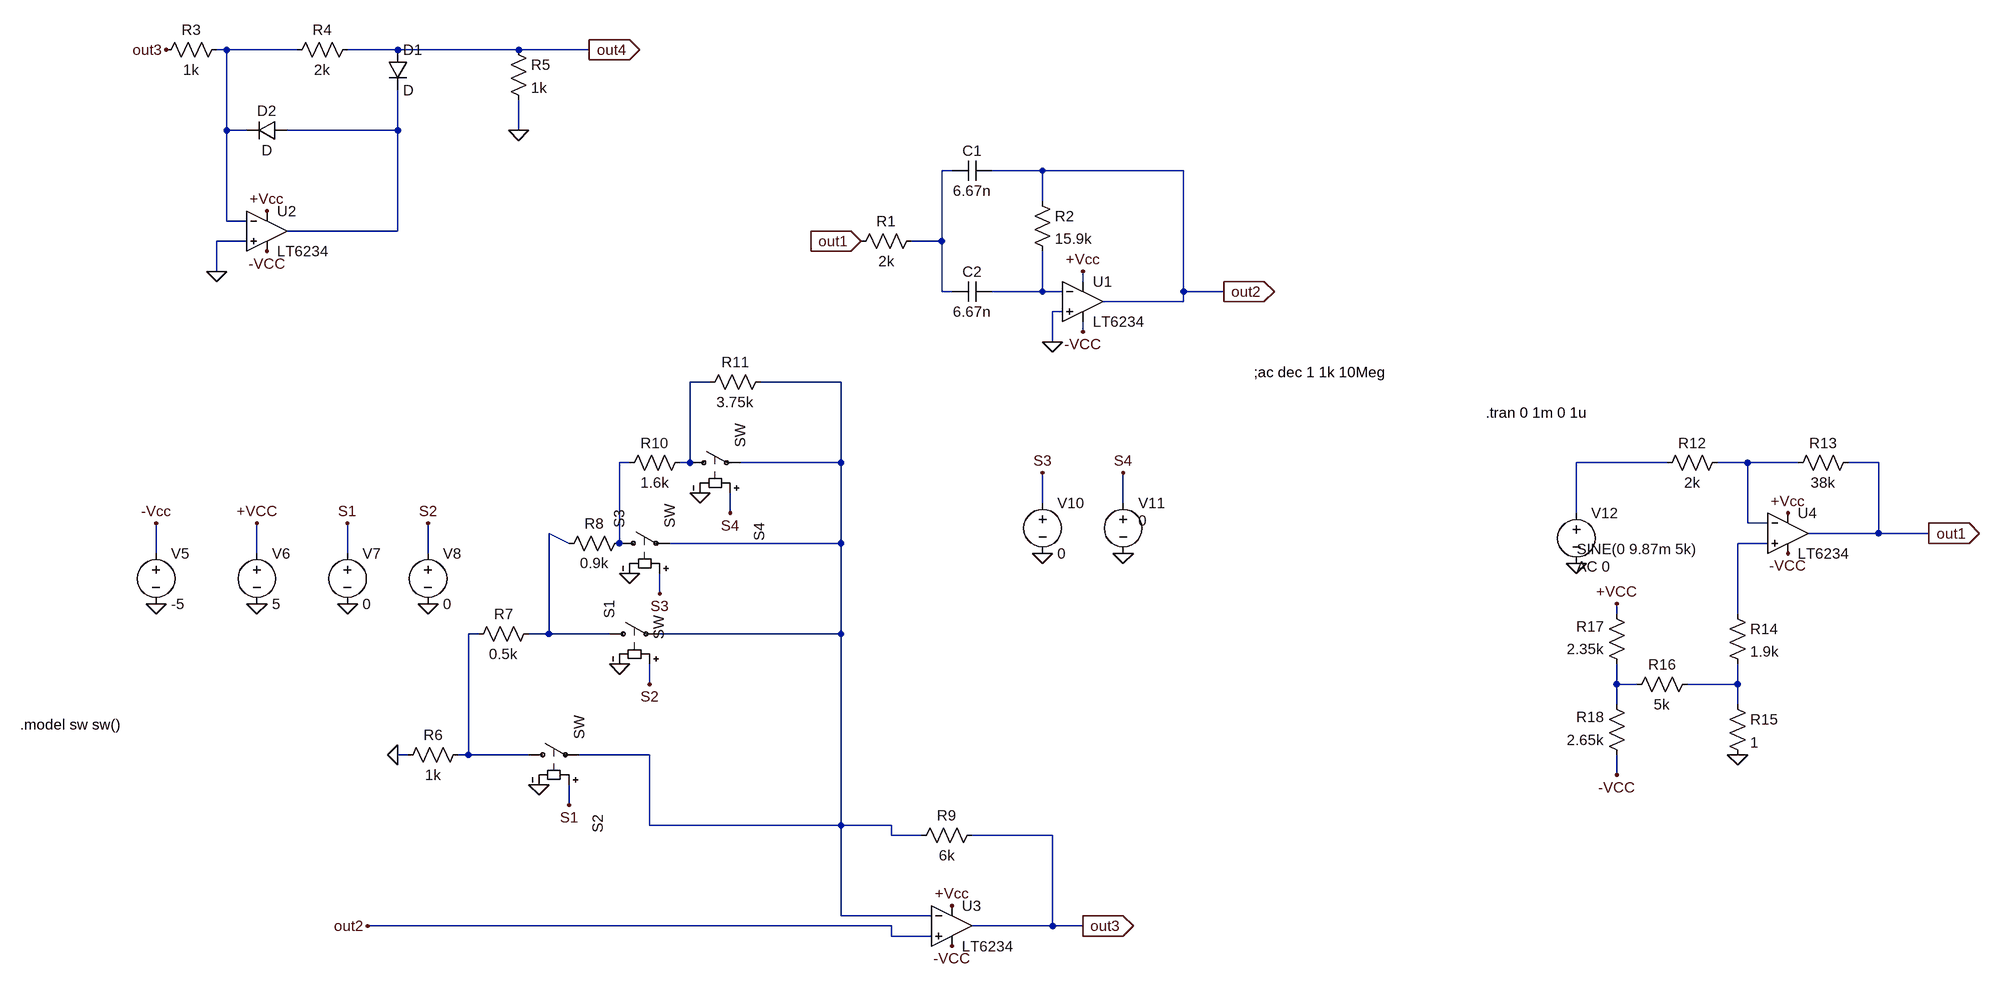
[diagram p0: schematic AnalogInterface.asc]
AnalogInterface.asc, the LTspice schematic file:
Version 4
SHEET 1 1648 1364
WIRE -1168 -160 -1184 -160
WIRE -1056 -160 -1168 -160
WIRE -896 -160 -976 -160
WIRE -704 -160 -896 -160
WIRE -592 -160 -704 -160
WIRE -1168 -32 -1168 -160
WIRE -1136 -32 -1168 -32
WIRE -896 -32 -896 -96
WIRE -896 -32 -1072 -32
WIRE -704 -32 -704 -80
WIRE -16 32 -32 32
WIRE 128 32 48 32
WIRE 352 32 128 32
WIRE 128 80 128 32
WIRE -1168 112 -1168 -32
WIRE -1136 112 -1168 112
WIRE -896 128 -896 -32
WIRE -896 128 -1072 128
WIRE -1136 144 -1184 144
WIRE -32 144 -32 32
WIRE -32 144 -80 144
WIRE -1184 192 -1184 144
WIRE 192 208 192 192
WIRE -32 224 -32 144
WIRE -16 224 -32 224
WIRE 128 224 128 160
WIRE 128 224 48 224
WIRE 160 224 128 224
WIRE 352 224 352 32
WIRE 416 224 352 224
WIRE 352 240 352 224
WIRE 352 240 224 240
WIRE 160 256 144 256
WIRE 192 288 192 272
WIRE 144 304 144 256
WIRE -400 368 -432 368
WIRE -192 368 -320 368
WIRE -528 496 -544 496
WIRE -432 496 -432 368
WIRE -432 496 -448 496
WIRE -192 496 -192 368
WIRE -192 496 -352 496
WIRE 1120 496 976 496
WIRE 1248 496 1200 496
WIRE 1328 496 1248 496
WIRE 1456 496 1408 496
WIRE 128 560 128 512
WIRE 256 560 256 512
WIRE -368 576 -368 544
WIRE 976 576 976 496
WIRE 1248 592 1248 496
WIRE 1280 592 1248 592
WIRE 1456 608 1456 496
WIRE 1456 608 1344 608
WIRE 1536 608 1456 608
WIRE -624 624 -656 608
WIRE -544 624 -544 496
WIRE -192 624 -192 496
WIRE -192 624 -464 624
WIRE 1280 624 1232 624
WIRE -1280 640 -1280 592
WIRE -1120 640 -1120 592
WIRE -976 640 -976 592
WIRE -848 640 -848 592
WIRE -480 704 -480 672
WIRE 1040 736 1040 720
WIRE 1232 736 1232 624
WIRE -768 768 -784 768
WIRE -656 768 -656 608
WIRE -656 768 -688 768
WIRE -560 768 -656 768
WIRE -192 768 -192 624
WIRE -192 768 -480 768
WIRE -496 848 -496 816
WIRE 1040 848 1040 816
WIRE 1072 848 1040 848
WIRE 1232 848 1232 816
WIRE 1232 848 1152 848
WIRE 1040 880 1040 848
WIRE 1232 880 1232 848
WIRE -880 960 -896 960
WIRE -784 960 -784 768
WIRE -784 960 -800 960
WIRE -688 960 -784 960
WIRE -496 960 -608 960
WIRE 1040 992 1040 960
WIRE -624 1040 -624 1008
WIRE -496 1072 -496 960
WIRE -192 1072 -192 768
WIRE -192 1072 -496 1072
WIRE -112 1072 -192 1072
WIRE -112 1088 -112 1072
WIRE -64 1088 -112 1088
WIRE 144 1088 16 1088
WIRE -192 1216 -192 1072
WIRE -48 1216 -192 1216
WIRE -112 1232 -944 1232
WIRE 144 1232 144 1088
WIRE 144 1232 16 1232
WIRE 192 1232 144 1232
WIRE -112 1248 -112 1232
WIRE -48 1248 -112 1248
FLAG 144 304 0
FLAG 192 288 -VCC
FLAG 192 192 +Vcc
FLAG 416 224 out2
IOPIN 416 224 Out
FLAG -1104 160 -VCC
FLAG -1104 96 +Vcc
FLAG -1184 192 0
FLAG -704 -32 0
FLAG -592 -160 out4
IOPIN -592 -160 Out
FLAG -16 1264 -VCC
FLAG -16 1200 +Vcc
FLAG -896 960 0
FLAG 192 1232 out3
IOPIN 192 1232 Out
FLAG -1280 720 0
FLAG -1120 720 0
FLAG -1280 592 -Vcc
FLAG -1120 592 +VCC
FLAG -976 720 0
FLAG -848 720 0
FLAG -976 592 S1
FLAG -848 592 S2
FLAG -672 1008 0
FLAG -544 816 0
FLAG -624 1040 S1
FLAG -496 848 S2
FLAG -528 672 0
FLAG -480 704 S3
FLAG -416 544 0
FLAG -368 576 S4
FLAG 128 640 0
FLAG 256 640 0
FLAG 128 512 S3
FLAG 256 512 S4
FLAG 976 656 0
FLAG 1232 960 0
FLAG 1312 576 +Vcc
FLAG 1040 992 -VCC
FLAG 1312 640 -VCC
FLAG 1040 720 +VCC
FLAG 1536 608 out1
IOPIN 1536 608 Out
FLAG -160 144 out1
IOPIN -160 144 In
FLAG -944 1232 out2
FLAG -1264 -160 out3
DATAFLAG -320 1072 ""
DATAFLAG -352 1232 ""
DATAFLAG 64 1088 ""
DATAFLAG -288 768 ""
DATAFLAG -272 624 ""
DATAFLAG -272 496 ""
DATAFLAG -272 368 ""
DATAFLAG -784 784 ""
DATAFLAG -656 704 ""
DATAFLAG -720 960 ""
DATAFLAG -608 768 ""
DATAFLAG -496 1232 ""
DATAFLAG 1472 608 ""
SYMBOL res -64 128 R90
WINDOW 0 0 56 VBottom 2
WINDOW 3 32 56 VTop 2
SYMATTR InstName R1
SYMATTR Value 2k
SYMBOL cap 48 16 R90
WINDOW 0 0 32 VBottom 2
WINDOW 3 32 32 VTop 2
SYMATTR InstName C1
SYMATTR Value 6.67n
SYMBOL cap 48 208 R90
WINDOW 0 0 32 VBottom 2
WINDOW 3 32 32 VTop 2
SYMATTR InstName C2
SYMATTR Value 6.67n
SYMBOL res 112 64 R0
SYMATTR InstName R2
SYMATTR Value 15.9k
SYMBOL OpAmps\\LT6234 192 240 R0
SYMATTR InstName U1
SYMBOL res -1168 -176 R90
WINDOW 0 0 56 VBottom 2
WINDOW 3 32 56 VTop 2
SYMATTR InstName R3
SYMATTR Value 1k
SYMBOL res -960 -176 R90
WINDOW 0 0 56 VBottom 2
WINDOW 3 32 56 VTop 2
SYMATTR InstName R4
SYMATTR Value 2k
SYMBOL diode -912 -160 R0
SYMATTR InstName D1
SYMBOL diode -1072 -48 R90
WINDOW 0 0 32 VBottom 2
WINDOW 3 32 32 VTop 2
SYMATTR InstName D2
SYMBOL res -720 -176 R0
SYMATTR InstName R5
SYMATTR Value 1k
SYMBOL OpAmps\\LT6234 -1104 128 R0
SYMATTR InstName U2
SYMBOL OpAmps\\LT6234 -16 1232 R0
SYMATTR InstName U3
SYMBOL res -784 944 R90
WINDOW 0 0 56 VBottom 2
WINDOW 3 32 56 VTop 2
SYMATTR InstName R6
SYMATTR Value 1k
SYMBOL res -672 752 R90
WINDOW 0 0 56 VBottom 2
WINDOW 3 32 56 VTop 2
SYMATTR InstName R7
SYMATTR Value 0.5k
SYMBOL res -528 608 R90
WINDOW 0 0 56 VBottom 2
WINDOW 3 32 56 VTop 2
SYMATTR InstName R8
SYMATTR Value 0.9k
SYMBOL res 32 1072 R90
WINDOW 0 0 56 VBottom 2
WINDOW 3 32 56 VTop 2
SYMATTR InstName R9
SYMATTR Value 6k
SYMBOL voltage -1280 624 R0
SYMATTR InstName V5
SYMATTR Value -5
SYMBOL voltage -1120 624 R0
SYMATTR InstName V6
SYMATTR Value 5
SYMBOL voltage -976 624 R0
SYMATTR InstName V7
SYMATTR Value 0
SYMBOL voltage -848 624 R0
SYMATTR InstName V8
SYMATTR Value 0
SYMBOL sw -576 768 R270
WINDOW 3 -9 95 Left 2
SYMATTR InstName S1
SYMBOL sw -704 960 R270
WINDOW 0 -125 126 Left 2
SYMATTR InstName S2
SYMBOL sw -560 624 R270
SYMATTR InstName S3
SYMBOL res -432 480 R90
WINDOW 0 0 56 VBottom 2
WINDOW 3 32 56 VTop 2
SYMATTR InstName R10
SYMATTR Value 1.6k
SYMBOL sw -448 496 R270
WINDOW 0 -125 126 Left 2
SYMATTR InstName S4
SYMBOL res -304 352 R90
WINDOW 0 0 56 VBottom 2
WINDOW 3 32 56 VTop 2
SYMATTR InstName R11
SYMATTR Value 3.75k
SYMBOL voltage 128 544 R0
SYMATTR InstName V10
SYMATTR Value 0
SYMBOL voltage 256 544 R0
WINDOW 3 24 44 Left 2
WINDOW 123 0 0 Left 0
WINDOW 39 0 0 Left 0
SYMATTR Value 0
SYMATTR InstName V11
SYMBOL voltage 976 560 R0
WINDOW 3 1 73 Left 2
WINDOW 123 1 101 Left 2
WINDOW 39 0 0 Left 0
SYMATTR Value SINE(0 9.87m 5k)
SYMATTR Value2 AC 0
SYMATTR InstName V12
SYMBOL res 1216 480 R90
WINDOW 0 0 56 VBottom 2
WINDOW 3 32 56 VTop 2
SYMATTR InstName R12
SYMATTR Value 2k
SYMBOL res 1424 480 R90
WINDOW 0 0 56 VBottom 2
WINDOW 3 32 56 VTop 2
SYMATTR InstName R13
SYMATTR Value 38k
SYMBOL OpAmps\\LT6234 1312 608 R0
SYMATTR InstName U4
SYMBOL res 1216 720 R0
SYMATTR InstName R14
SYMATTR Value 1.9k
SYMBOL res 1216 864 R0
SYMATTR InstName R15
SYMATTR Value 1
SYMBOL res 1168 832 R90
WINDOW 0 0 56 VBottom 2
WINDOW 3 32 56 VTop 2
SYMATTR InstName R16
SYMATTR Value 5k
SYMBOL res 1056 832 R180
WINDOW 0 36 76 Left 2
WINDOW 3 36 40 Left 2
SYMATTR InstName R17
SYMATTR Value 2.35k
SYMBOL res 1056 976 R180
WINDOW 0 36 76 Left 2
WINDOW 3 36 40 Left 2
SYMATTR InstName R18
SYMATTR Value 2.65k
TEXT 464 352 Left 2 !;ac dec 1 1k 10Meg
TEXT 832 416 Left 2 !.tran 0 1m 0 1u
TEXT -1496 912 Left 2 !.model sw sw()

The netlist it stands for:
* AnalogInterface.asc
R1 N003 out1 2k
C1 out2 N003 6.67n
C2 N004 N003 6.67n
R2 out2 N004 15.9k
* U1: LT6234 (symbol OpAmps\LT6234 not available, pins judged from their places): In+=0 In-=N004 V+=+Vcc V-=-VCC OUT=out2
R3 N001 out3 1k
R4 out4 N001 2k
D1 out4 N002 D
D2 N002 N001 D
R5 out4 0 1k
* U2: LT6234 (symbol OpAmps\LT6234 not available, pins judged from their places): In+=0 In-=N001 V+=+Vcc V-=-VCC OUT=N002
* U3: LT6234 (symbol OpAmps\LT6234 not available, pins judged from their places): In+=out2 In-=N006 V+=+Vcc V-=-VCC OUT=out3
R6 N012 0 1k
R7 N010 N012 0.5k
R8 N007 N010 0.9k
R9 out3 N006 6k
V5 -VCC 0 -5
V6 +Vcc 0 5
V7 S1 0 0
V8 S2 0 0
S1 N010 N006 S2 0 SW
S2 N012 N006 S1 0 SW
S3 N007 N006 S3 0 SW
R10 N005 N007 1.6k
S4 N005 N006 S4 0 SW
R11 N006 N005 3.75k
V10 S3 0 0
V11 S4 0 0
V12 N008 0 SINE(0 9.87m 5k) AC 0
R12 N009 N008 2k
R13 out1 N009 38k
* U4: LT6234 (symbol OpAmps\LT6234 not available, pins judged from their places): In+=N011 In-=N009 V+=+Vcc V-=-VCC OUT=out1
R14 N011 N014 1.9k
R15 N014 0 1
R16 N014 N013 5k
R17 N013 +Vcc 2.35k
R18 -VCC N013 2.65k
.model D D
.lib standard.dio
;ac dec 1 1k 10Meg
.tran 0 1m 0 1u
.model sw sw()
.backanno
.end